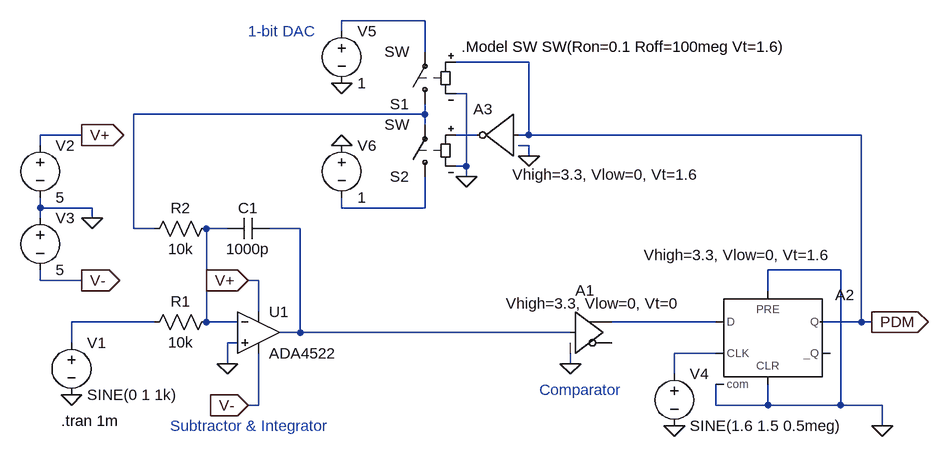
[diagram p0: schematic dsm_step2.asc]
dsm_step2.asc, the LTspice schematic file:
Version 4
SHEET 1 1752 680
WIRE 896 -368 768 -368
WIRE 768 -352 768 -368
WIRE 896 -320 896 -368
WIRE 1056 -304 944 -304
WIRE 960 -256 944 -256
WIRE 896 -224 896 -240
WIRE 896 -224 448 -224
WIRE 896 -208 896 -224
WIRE 368 -192 304 -192
WIRE 976 -192 944 -192
WIRE 1056 -192 1056 -304
WIRE 1056 -192 1040 -192
WIRE 1568 -192 1056 -192
WIRE 304 -176 304 -192
WIRE 1056 -176 1040 -176
WIRE 1056 -160 1056 -176
WIRE 960 -144 960 -256
WIRE 960 -144 944 -144
WIRE 960 -128 960 -144
WIRE 304 -80 304 -96
WIRE 384 -80 304 -80
WIRE 768 -80 768 -96
WIRE 896 -80 896 -128
WIRE 896 -80 768 -80
WIRE 304 -64 304 -80
WIRE 384 -64 384 -80
WIRE 448 -48 448 -224
WIRE 480 -48 448 -48
WIRE 592 -48 560 -48
WIRE 704 -48 656 -48
WIRE 1536 16 1424 16
WIRE 304 32 304 16
WIRE 368 32 304 32
WIRE 640 32 624 32
WIRE 1424 48 1424 16
WIRE 640 80 640 32
WIRE 480 96 352 96
WIRE 560 96 560 -48
WIRE 608 96 560 96
WIRE 1344 96 1184 96
WIRE 1568 96 1568 -192
WIRE 1568 96 1504 96
WIRE 1584 96 1568 96
WIRE 704 112 704 -48
WIRE 704 112 672 112
WIRE 1120 112 704 112
WIRE 352 128 352 96
WIRE 608 128 592 128
WIRE 1344 144 1280 144
WIRE 592 160 592 128
WIRE 1120 160 1120 144
WIRE 1280 176 1280 144
WIRE 640 224 640 144
WIRE 640 224 624 224
WIRE 1344 224 1344 192
WIRE 1424 224 1424 192
WIRE 1424 224 1344 224
WIRE 1536 224 1536 16
WIRE 1536 224 1424 224
WIRE 1600 224 1536 224
WIRE 1600 256 1600 224
FLAG 592 160 0
FLAG 352 208 0
FLAG 624 32 V+
IOPIN 624 32 In
FLAG 624 224 V-
IOPIN 624 224 In
FLAG 384 -64 0
FLAG 368 -192 V+
IOPIN 368 -192 Out
FLAG 368 32 V-
IOPIN 368 32 Out
FLAG 1120 160 0
FLAG 1280 256 0
FLAG 1600 256 0
FLAG 1056 -160 0
FLAG 960 -128 0
FLAG 768 -272 0
FLAG 768 -176 0
FLAG 1584 96 PDM
IOPIN 1584 96 Out
SYMBOL voltage 352 112 R0
WINDOW 123 0 0 Left 0
WINDOW 39 0 0 Left 0
SYMATTR InstName V1
SYMATTR Value SINE(0 1 1k)
SYMBOL OpAmps\\ADA4522 640 48 R0
SYMATTR InstName U1
SYMBOL res 576 80 R90
WINDOW 0 0 56 VBottom 2
WINDOW 3 32 56 VTop 2
SYMATTR InstName R1
SYMATTR Value 10k
SYMBOL res 576 -64 R90
WINDOW 0 0 56 VBottom 2
WINDOW 3 32 56 VTop 2
SYMATTR InstName R2
SYMATTR Value 10k
SYMBOL cap 656 -64 R90
WINDOW 0 0 32 VBottom 2
WINDOW 3 32 32 VTop 2
SYMATTR InstName C1
SYMATTR Value 1000p
SYMBOL voltage 304 -192 R0
WINDOW 123 0 0 Left 0
WINDOW 39 0 0 Left 0
SYMATTR InstName V2
SYMATTR Value 5
SYMBOL voltage 304 -80 R0
WINDOW 123 0 0 Left 0
WINDOW 39 0 0 Left 0
SYMATTR InstName V3
SYMATTR Value 5
SYMBOL Digital\\buf 1120 48 R0
WINDOW 0 8 -1 Left 2
WINDOW 3 -99 19 Left 2
SYMATTR InstName A1
SYMATTR Value Vhigh=3.3, Vlow=0, Vt=0
SYMBOL Digital\\dflop 1424 48 R0
WINDOW 3 -191 -55 Left 2
SYMATTR Value Vhigh=3.3, Vlow=0, Vt=1.6
SYMATTR InstName A2
SYMBOL voltage 1280 160 R0
WINDOW 123 0 0 Left 0
WINDOW 39 0 0 Left 0
SYMATTR InstName V4
SYMATTR Value SINE(1.6 1.5 0.5meg)
SYMBOL sw 896 -224 R180
SYMATTR InstName S1
SYMBOL sw 896 -112 R180
SYMATTR InstName S2
SYMBOL Digital\\inv 1040 -256 M0
WINDOW 3 -277 125 Left 2
SYMATTR Value Vhigh=3.3, Vlow=0, Vt=1.6
SYMATTR InstName A3
SYMBOL voltage 768 -368 R0
WINDOW 123 0 0 Left 0
WINDOW 39 0 0 Left 0
SYMATTR InstName V5
SYMATTR Value 1
SYMBOL voltage 768 -192 R0
WINDOW 123 0 0 Left 0
WINDOW 39 0 0 Left 0
SYMATTR InstName V6
SYMATTR Value 1
TEXT 504 256 Left 2 ;Subtractor & Integrator
TEXT 1072 200 Left 2 ;Comparator
TEXT 952 -328 Left 2 !.Model SW SW(Ron=0.1 Roff=100meg Vt=1.6)
TEXT 624 -352 Left 2 ;1-bit DAC
TEXT 336 248 Left 2 !.tran 1m

The netlist it stands for:
* dsm_step2.asc
V1 N007 0 SINE(0 1 1k)
XU1 0 N005 V+ V- N006 ADA4522  ; pins In+ In- V+ V- OUT
R1 N005 N007 10k
R2 N005 N002 10k
C1 N006 N005 1000p
V2 V+ 0 5
V3 0 V- 5
A1 N006 0 0 0 0 0 N008 0 BUF Vhigh=3.3, Vlow=0, Vt=0
A2 N008 0 N009 0 0 0 PDM 0 DFLOP Vhigh=3.3, Vlow=0, Vt=1.6
V4 N009 0 SINE(1.6 1.5 0.5meg)
S1 N002 N001 PDM 0 SW
S2 N004 N002 N003 0 SW
A3 PDM 0 0 0 0 N003 0 0 BUF Vhigh=3.3, Vlow=0, Vt=1.6
V5 N001 0 1
V6 0 N004 1
* Subtractor & Integrator
* Comparator
.Model SW SW(Ron=0.1 Roff=100meg Vt=1.6)
* 1-bit DAC
.tran 1m
.backanno
.end